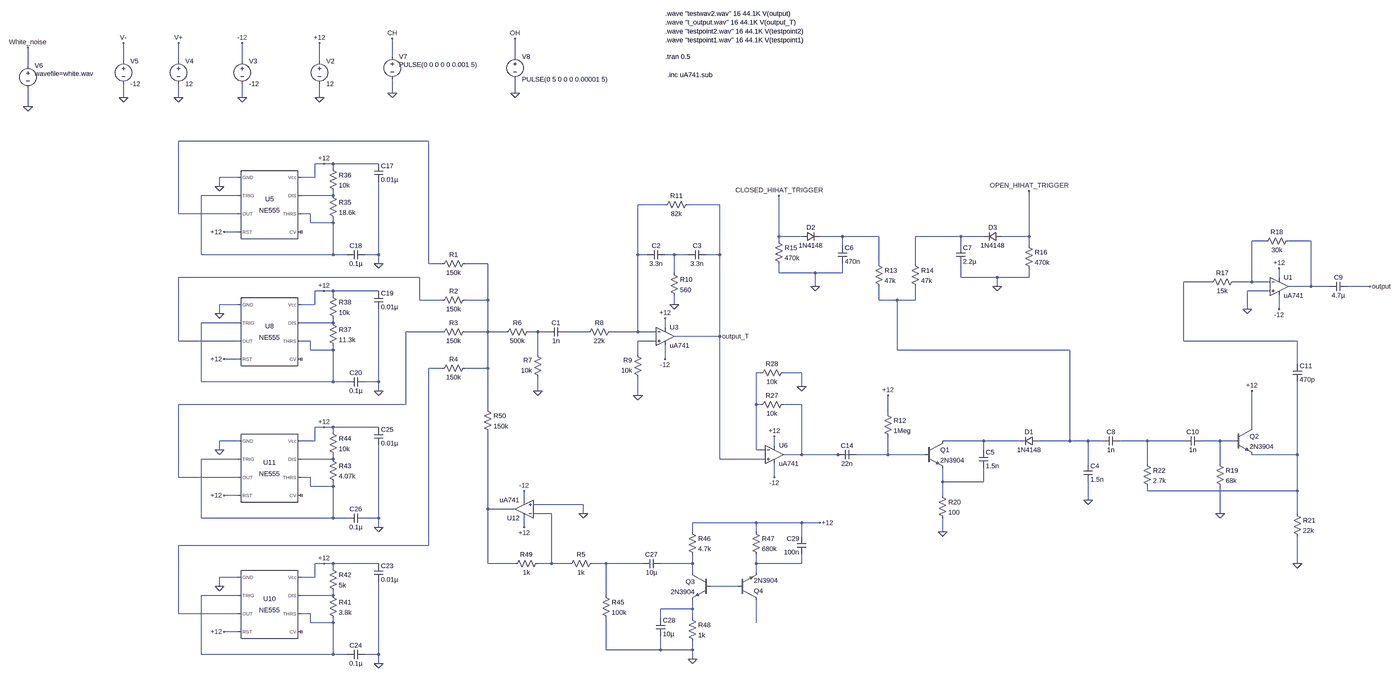
[diagram p0: schematic Hi Hat Cymbal (With analog white noise generator).asc, whole sheet]
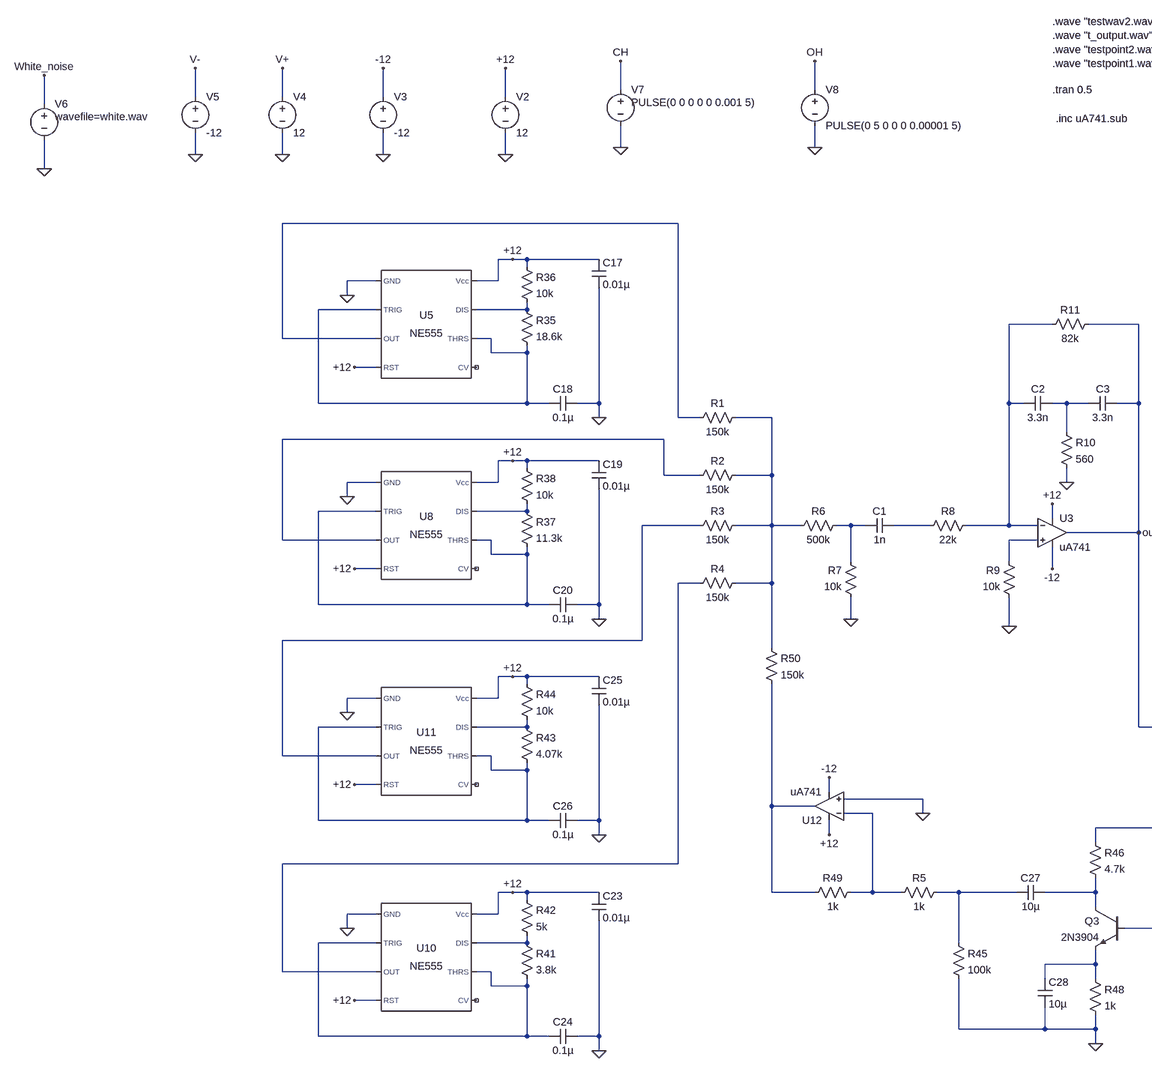
[diagram p1: schematic Hi Hat Cymbal (With analog white noise generator).asc, part, row 1 of 1, column 1 of 2]
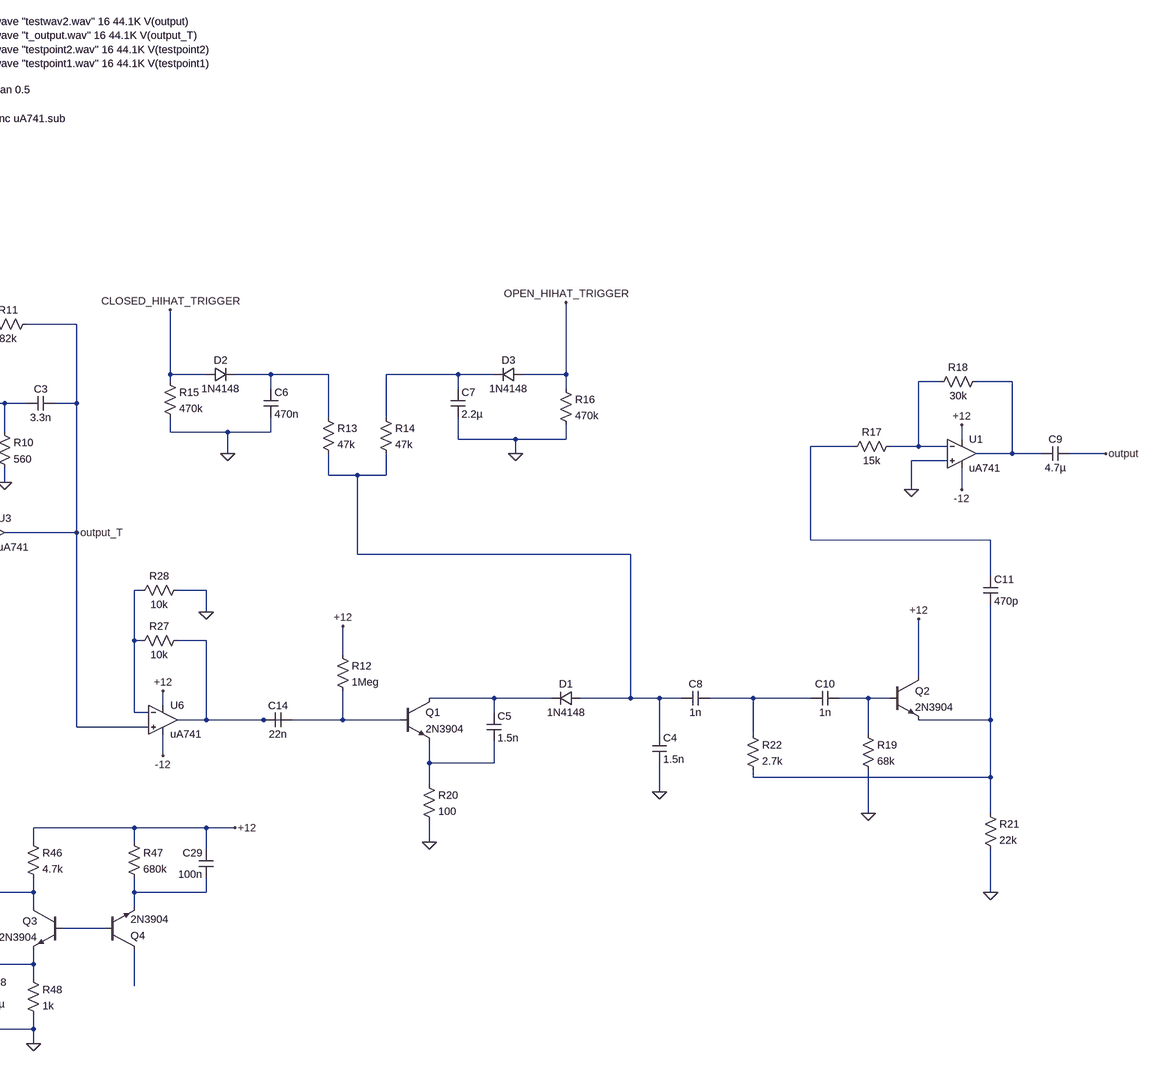
[diagram p2: schematic Hi Hat Cymbal (With analog white noise generator).asc, part, row 1 of 1, column 2 of 2]
Hi Hat Cymbal (With analog white noise generator).asc, the LTspice schematic file:
Version 4
SHEET 1 5820 2708
WIRE -128 -1024 -128 -1088
WIRE 304 -1024 304 -1088
WIRE -1152 -1008 -1152 -1072
WIRE -880 -1008 -880 -1072
WIRE -656 -1008 -656 -1072
WIRE -384 -1008 -384 -1072
WIRE -1488 -992 -1488 -1056
WIRE -128 -896 -128 -944
WIRE 304 -896 304 -944
WIRE -1152 -880 -1152 -928
WIRE -880 -880 -880 -928
WIRE -656 -880 -656 -928
WIRE -384 -880 -384 -928
WIRE -1488 -848 -1488 -912
WIRE 0 -320 -880 -320
WIRE -368 -240 -400 -240
WIRE -336 -240 -368 -240
WIRE -176 -240 -336 -240
WIRE -336 -224 -336 -240
WIRE -672 -192 -736 -192
WIRE -400 -192 -400 -240
WIRE -400 -192 -448 -192
WIRE -736 -160 -736 -192
WIRE -672 -128 -800 -128
WIRE -336 -128 -336 -144
WIRE -336 -128 -448 -128
WIRE 832 -96 736 -96
WIRE 1024 -96 912 -96
WIRE -880 -64 -880 -320
WIRE -672 -64 -880 -64
WIRE -416 -64 -448 -64
WIRE -416 -32 -416 -64
WIRE -336 -32 -336 -48
WIRE -336 -32 -416 -32
WIRE -672 0 -720 0
WIRE 1232 16 1232 -128
WIRE 1312 16 1232 16
WIRE 1456 16 1376 16
WIRE 1584 16 1456 16
WIRE 1872 16 1712 16
WIRE 1952 16 1872 16
WIRE 2112 16 2112 -144
WIRE 2112 16 2016 16
WIRE 1232 32 1232 16
WIRE 2944 32 2896 32
WIRE 3104 32 3024 32
WIRE 1456 48 1456 16
WIRE 1872 48 1872 16
WIRE 2112 48 2112 16
WIRE -800 80 -800 -128
WIRE -336 80 -336 -32
WIRE -336 80 -800 80
WIRE -288 80 -336 80
WIRE -176 80 -176 -176
WIRE -176 80 -224 80
WIRE 736 80 736 -96
WIRE 768 80 736 80
WIRE 864 80 832 80
WIRE 912 80 864 80
WIRE 1024 80 1024 -96
WIRE 1024 80 976 80
WIRE -176 112 -176 80
WIRE 0 112 0 -320
WIRE 48 112 0 112
WIRE 208 112 128 112
WIRE 1584 112 1584 16
WIRE 1712 112 1712 16
WIRE 864 144 864 80
WIRE 1232 144 1232 112
WIRE 1360 144 1232 144
WIRE 1456 144 1456 112
WIRE 1456 144 1360 144
WIRE -32 160 -880 160
WIRE 1872 160 1872 112
WIRE 2000 160 1872 160
WIRE 2112 160 2112 128
WIRE 2112 160 2000 160
WIRE 2992 160 2992 128
WIRE 2752 176 2656 176
WIRE 2896 176 2896 32
WIRE 2896 176 2832 176
WIRE 2960 176 2896 176
WIRE 1360 192 1360 144
WIRE 2000 192 2000 160
WIRE 3104 192 3104 32
WIRE 3104 192 3024 192
WIRE 3168 192 3104 192
WIRE 3312 192 3232 192
WIRE -368 208 -400 208
WIRE -336 208 -368 208
WIRE -176 208 -336 208
WIRE 2960 208 2880 208
WIRE -336 224 -336 208
WIRE -32 240 -32 160
WIRE 48 240 -32 240
WIRE 208 240 208 112
WIRE 208 240 128 240
WIRE 1584 240 1584 192
WIRE 1648 240 1584 240
WIRE 1712 240 1712 192
WIRE 1712 240 1648 240
WIRE -672 256 -736 256
WIRE -400 256 -400 208
WIRE -400 256 -448 256
WIRE 864 256 864 224
WIRE 2880 272 2880 208
WIRE 2992 272 2992 224
WIRE -736 288 -736 256
WIRE -672 320 -800 320
WIRE -336 320 -336 304
WIRE -336 320 -448 320
WIRE 832 336 832 304
WIRE 48 352 -80 352
WIRE 208 352 208 240
WIRE 208 352 128 352
WIRE 272 352 208 352
WIRE 384 352 352 352
WIRE 416 352 384 352
WIRE 560 352 480 352
WIRE 736 352 736 80
WIRE 736 352 640 352
WIRE 800 352 736 352
WIRE 1024 368 1024 80
WIRE 1024 368 864 368
WIRE -880 384 -880 160
WIRE -672 384 -880 384
WIRE -416 384 -448 384
WIRE 800 384 736 384
WIRE 2656 384 2656 176
WIRE 3056 384 2656 384
WIRE -416 416 -416 384
WIRE -336 416 -336 400
WIRE -336 416 -416 416
WIRE 1648 416 1648 240
WIRE 2256 416 1648 416
WIRE 384 432 384 352
WIRE 736 432 736 384
WIRE -672 448 -720 448
WIRE 832 448 832 400
WIRE 3056 464 3056 384
WIRE 48 480 0 480
WIRE 208 480 208 352
WIRE 208 480 128 480
WIRE 1168 496 1152 496
WIRE 1312 496 1248 496
WIRE -800 528 -800 320
WIRE -336 528 -336 416
WIRE -336 528 -800 528
WIRE -288 528 -336 528
WIRE -176 528 -176 272
WIRE -176 528 -224 528
WIRE 1312 544 1312 496
WIRE -176 560 -176 528
WIRE 384 560 384 512
WIRE 736 576 736 512
WIRE -80 608 -80 352
WIRE -80 608 -880 608
WIRE 1152 608 1152 496
WIRE 1168 608 1152 608
WIRE 1312 608 1248 608
WIRE 208 624 208 480
WIRE 1616 640 1616 576
WIRE -368 688 -400 688
WIRE -336 688 -368 688
WIRE -176 688 -336 688
WIRE 2896 688 2896 560
WIRE -336 704 -336 688
WIRE -672 736 -736 736
WIRE -400 736 -400 688
WIRE -400 736 -448 736
WIRE 1952 736 1808 736
WIRE 2080 736 1952 736
WIRE 2256 736 2256 416
WIRE 2256 736 2144 736
WIRE 2320 736 2256 736
WIRE 2368 736 2320 736
WIRE 2528 736 2432 736
WIRE 2656 736 2528 736
WIRE 2784 736 2720 736
WIRE 2832 736 2784 736
WIRE 1216 752 1216 720
WIRE -736 768 -736 736
WIRE 1152 768 1152 608
WIRE 1184 768 1152 768
WIRE 1952 768 1952 736
WIRE 1312 784 1312 608
WIRE 1312 784 1248 784
WIRE 1440 784 1312 784
WIRE 1488 784 1440 784
WIRE 1616 784 1616 720
WIRE 1616 784 1504 784
WIRE 1744 784 1616 784
WIRE 3056 784 3056 528
WIRE 3056 784 2896 784
WIRE -672 800 -800 800
WIRE -336 800 -336 784
WIRE -336 800 -448 800
WIRE 1024 800 1024 368
WIRE 1184 800 1024 800
WIRE 2320 816 2320 736
WIRE 2528 816 2528 736
WIRE 2784 816 2784 736
WIRE -880 864 -880 608
WIRE -672 864 -880 864
WIRE -416 864 -448 864
WIRE 1216 864 1216 816
WIRE 1808 880 1808 832
WIRE 1952 880 1952 832
WIRE 1952 880 1808 880
WIRE -416 896 -416 864
WIRE -336 896 -336 880
WIRE -336 896 -416 896
WIRE 2528 912 2528 896
WIRE 3056 912 3056 784
WIRE 3056 912 2528 912
WIRE -672 928 -720 928
WIRE 1808 928 1808 880
WIRE 336 944 336 912
WIRE 2320 944 2320 880
WIRE 544 960 368 960
WIRE 208 976 208 704
WIRE 304 976 208 976
WIRE 432 992 368 992
WIRE 544 992 544 960
WIRE 2784 992 2784 896
WIRE 3056 992 3056 912
WIRE -800 1008 -800 800
WIRE -336 1008 -336 896
WIRE -336 1008 -800 1008
WIRE -288 1008 -336 1008
WIRE -176 1008 -176 752
WIRE -176 1008 -224 1008
WIRE 1152 1024 928 1024
WIRE 1312 1024 1152 1024
WIRE 1376 1024 1312 1024
WIRE -176 1040 -176 1008
WIRE 336 1040 336 1008
WIRE 928 1056 928 1024
WIRE 1152 1056 1152 1024
WIRE 1808 1056 1808 1008
WIRE 1312 1072 1312 1024
WIRE 0 1104 0 480
WIRE 0 1104 -880 1104
WIRE -368 1168 -400 1168
WIRE -336 1168 -368 1168
WIRE -176 1168 -336 1168
WIRE 208 1168 208 976
WIRE 304 1168 208 1168
WIRE 432 1168 432 992
WIRE 432 1168 384 1168
WIRE 496 1168 432 1168
WIRE 624 1168 576 1168
WIRE 752 1168 624 1168
WIRE 928 1168 928 1136
WIRE 928 1168 816 1168
WIRE 1152 1168 1152 1136
WIRE 1312 1168 1312 1136
WIRE 1312 1168 1152 1168
WIRE 3056 1168 3056 1072
WIRE -336 1184 -336 1168
WIRE 928 1200 928 1168
WIRE 1152 1200 1152 1168
WIRE -672 1216 -736 1216
WIRE -400 1216 -400 1168
WIRE -400 1216 -448 1216
WIRE -736 1248 -736 1216
WIRE 1088 1248 992 1248
WIRE -672 1280 -800 1280
WIRE -336 1280 -336 1264
WIRE -336 1280 -448 1280
WIRE 624 1280 624 1168
WIRE 928 1328 928 1296
WIRE 928 1328 816 1328
WIRE -880 1344 -880 1104
WIRE -672 1344 -880 1344
WIRE -416 1344 -448 1344
WIRE 816 1360 816 1328
WIRE 928 1360 928 1328
WIRE -416 1376 -416 1344
WIRE -336 1376 -336 1360
WIRE -336 1376 -416 1376
WIRE 1152 1376 1152 1296
WIRE -672 1408 -720 1408
WIRE 624 1472 624 1360
WIRE 816 1472 816 1424
WIRE 816 1472 624 1472
WIRE 928 1472 928 1440
WIRE 928 1472 816 1472
WIRE -800 1488 -800 1280
WIRE -336 1488 -336 1376
WIRE -336 1488 -800 1488
WIRE -288 1488 -336 1488
WIRE -176 1488 -176 1232
WIRE -176 1488 -224 1488
WIRE 928 1504 928 1472
WIRE -176 1520 -176 1488
FLAG 384 560 0
FLAG 736 576 0
FLAG 864 256 0
FLAG 1616 576 +12
FLAG -384 -880 0
FLAG -656 -880 0
FLAG -384 -1072 +12
FLAG -656 -1072 -12
FLAG 832 448 -12
FLAG 832 304 +12
FLAG 1360 192 0
FLAG 1232 -128 CLOSED_HIHAT_TRIGGER
FLAG 2112 -144 OPEN_HIHAT_TRIGGER
FLAG 2000 192 0
FLAG -880 -880 0
FLAG -1152 -880 0
FLAG -880 -1072 V+
FLAG -1152 -1072 V-
FLAG -1488 -848 0
FLAG -1488 -1056 White_noise
FLAG 2992 272 -12
FLAG 2992 128 +12
FLAG 2880 272 0
FLAG -128 -896 0
FLAG -128 -1088 CH
FLAG 3312 192 output
FLAG 304 -896 0
FLAG 304 -1088 OH
FLAG 1024 368 output_T
FLAG 1808 1056 0
FLAG 1216 864 -12
FLAG 1216 720 +12
FLAG 2320 944 0
FLAG 2896 560 +12
FLAG 2784 992 0
FLAG 3056 1168 0
FLAG -736 -160 0
FLAG -368 -240 +12
FLAG -720 0 +12
FLAG -176 112 0
FLAG -736 288 0
FLAG -368 208 +12
FLAG -720 448 +12
FLAG -176 560 0
FLAG -736 1248 0
FLAG -368 1168 +12
FLAG -720 1408 +12
FLAG -176 1520 0
FLAG -736 768 0
FLAG -368 688 +12
FLAG -720 928 +12
FLAG -176 1040 0
FLAG 928 1504 0
FLAG 1376 1024 +12
FLAG 336 912 -12
FLAG 336 1040 +12
FLAG 544 992 0
FLAG 1312 544 0
SYMBOL res 144 96 R90
WINDOW 0 0 56 VBottom 2
WINDOW 3 32 56 VTop 2
SYMATTR InstName R1
SYMATTR Value 150k
SYMBOL res 144 224 R90
WINDOW 0 0 56 VBottom 2
WINDOW 3 32 56 VTop 2
SYMATTR InstName R2
SYMATTR Value 150k
SYMBOL res 144 336 R90
WINDOW 0 0 56 VBottom 2
WINDOW 3 32 56 VTop 2
SYMATTR InstName R3
SYMATTR Value 150k
SYMBOL res 144 464 R90
WINDOW 0 0 56 VBottom 2
WINDOW 3 32 56 VTop 2
SYMATTR InstName R4
SYMATTR Value 150k
SYMBOL res 368 336 R90
WINDOW 0 0 56 VBottom 2
WINDOW 3 32 56 VTop 2
SYMATTR InstName R6
SYMATTR Value 500k
SYMBOL res 400 528 R180
WINDOW 0 36 76 Left 2
WINDOW 3 36 40 Left 2
SYMATTR InstName R7
SYMATTR Value 10k
SYMBOL cap 480 336 R90
WINDOW 0 0 32 VBottom 2
WINDOW 3 32 32 VTop 2
SYMATTR InstName C1
SYMATTR Value 1n
SYMBOL res 656 336 R90
WINDOW 0 0 56 VBottom 2
WINDOW 3 32 56 VTop 2
SYMATTR InstName R8
SYMATTR Value 22k
SYMBOL res 752 528 R180
WINDOW 0 36 76 Left 2
WINDOW 3 36 40 Left 2
SYMATTR InstName R9
SYMATTR Value 10k
SYMBOL cap 832 64 R90
WINDOW 0 0 32 VBottom 2
WINDOW 3 32 32 VTop 2
SYMATTR InstName C2
SYMATTR Value 3.3n
SYMBOL cap 976 64 R90
WINDOW 0 0 32 VBottom 2
WINDOW 3 32 32 VTop 2
SYMATTR InstName C3
SYMATTR Value 3.3n
SYMBOL res 848 128 R0
SYMATTR InstName R10
SYMATTR Value 560
SYMBOL res 928 -112 R90
WINDOW 0 0 56 VBottom 2
WINDOW 3 32 56 VTop 2
SYMATTR InstName R11
SYMATTR Value 82k
SYMBOL res 1600 624 R0
SYMATTR InstName R12
SYMATTR Value 1Meg
SYMBOL npn 1744 736 R0
SYMATTR InstName Q1
SYMATTR Value 2N3904
SYMBOL cap 1936 768 R0
SYMATTR InstName C5
SYMATTR Value 1.5n
SYMBOL voltage -384 -1024 R0
WINDOW 123 0 0 Left 2
WINDOW 39 0 0 Left 2
SYMATTR InstName V2
SYMATTR Value 12
SYMBOL voltage -656 -1024 R0
WINDOW 123 0 0 Left 2
WINDOW 39 0 0 Left 2
SYMATTR InstName V3
SYMATTR Value -12
SYMBOL diode 2144 720 R90
WINDOW 0 0 32 VBottom 2
WINDOW 3 32 32 VTop 2
SYMATTR InstName D1
SYMATTR Value 1N4148
SYMBOL res 1568 96 R0
SYMATTR InstName R13
SYMATTR Value 47k
SYMBOL res 1696 96 R0
SYMATTR InstName R14
SYMATTR Value 47k
SYMBOL cap 1440 48 R0
SYMATTR InstName C6
SYMATTR Value 470n
SYMBOL diode 1312 32 R270
WINDOW 0 32 32 VTop 2
WINDOW 3 0 32 VBottom 2
SYMATTR InstName D2
SYMATTR Value 1N4148
SYMBOL res 1216 16 R0
SYMATTR InstName R15
SYMATTR Value 470k
SYMBOL cap 1856 48 R0
SYMATTR InstName C7
SYMATTR Value 2.2µ
SYMBOL diode 2016 0 R90
WINDOW 0 0 32 VBottom 2
WINDOW 3 32 32 VTop 2
SYMATTR InstName D3
SYMATTR Value 1N4148
SYMBOL res 2096 32 R0
SYMATTR InstName R16
SYMATTR Value 470k
SYMBOL cap 2432 720 R90
WINDOW 0 0 32 VBottom 2
WINDOW 3 32 32 VTop 2
SYMATTR InstName C8
SYMATTR Value 1n
SYMBOL voltage -880 -1024 R0
WINDOW 123 0 0 Left 2
WINDOW 39 0 0 Left 2
SYMATTR InstName V4
SYMATTR Value 12
SYMBOL voltage -1152 -1024 R0
WINDOW 123 0 0 Left 2
WINDOW 39 0 0 Left 2
SYMATTR InstName V5
SYMATTR Value -12
SYMBOL voltage -1488 -1008 R0
WINDOW 3 24 44 Left 2
SYMATTR Value wavefile=white.wav
SYMATTR InstName V6
SYMBOL res 2848 160 R90
WINDOW 0 0 56 VBottom 2
WINDOW 3 32 56 VTop 2
SYMATTR InstName R17
SYMATTR Value 15k
SYMBOL res 3040 16 R90
WINDOW 0 0 56 VBottom 2
WINDOW 3 32 56 VTop 2
SYMATTR InstName R18
SYMATTR Value 30k
SYMBOL cap 3232 176 R90
WINDOW 0 0 32 VBottom 2
WINDOW 3 32 32 VTop 2
SYMATTR InstName C9
SYMATTR Value 4.7µ
SYMBOL voltage -128 -1040 R0
WINDOW 123 0 0 Left 2
WINDOW 39 0 0 Left 2
WINDOW 3 24 44 Left 2
SYMATTR Value PULSE(0 0 0 0 0 0.001 5)
SYMATTR InstName V7
SYMBOL voltage 304 -1040 R0
WINDOW 123 0 0 Left 2
WINDOW 39 0 0 Left 2
SYMATTR InstName V8
SYMATTR Value PULSE(0 5 0 0 0 0.00001 5)
SYMBOL Opamps\\opamp2 832 304 R0
SYMATTR InstName U3
SYMATTR Value uA741
SYMBOL Opamps\\opamp2 2992 128 R0
SYMATTR InstName U1
SYMATTR Value uA741
SYMBOL res 1792 912 R0
SYMATTR InstName R20
SYMATTR Value 100
SYMBOL Opamps\\opamp2 1216 720 R0
SYMATTR InstName U6
SYMATTR Value uA741
SYMBOL res 1264 592 R90
WINDOW 0 0 56 VBottom 2
WINDOW 3 32 56 VTop 2
SYMATTR InstName R27
SYMATTR Value 10k
SYMBOL res 1152 512 R270
WINDOW 0 32 56 VTop 2
WINDOW 3 0 56 VBottom 2
SYMATTR InstName R28
SYMATTR Value 10k
SYMBOL cap 1504 768 R90
WINDOW 0 0 32 VBottom 2
WINDOW 3 32 32 VTop 2
SYMATTR InstName C14
SYMATTR Value 22n
SYMBOL cap 2304 816 R0
SYMATTR InstName C4
SYMATTR Value 1.5n
SYMBOL cap 2720 720 R90
WINDOW 0 0 32 VBottom 2
WINDOW 3 32 32 VTop 2
SYMATTR InstName C10
SYMATTR Value 1n
SYMBOL npn 2832 688 R0
SYMATTR InstName Q2
SYMATTR Value 2N3904
SYMBOL res 2768 800 R0
SYMATTR InstName R19
SYMATTR Value 68k
SYMBOL res 3040 976 R0
SYMATTR InstName R21
SYMATTR Value 22k
SYMBOL res 2512 800 R0
SYMATTR InstName R22
SYMATTR Value 2.7k
SYMBOL cap 3040 464 R0
SYMATTR InstName C11
SYMATTR Value 470p
SYMBOL Misc\\NE555 -560 -96 R0
SYMATTR InstName U5
SYMBOL res -352 -144 R0
SYMATTR InstName R35
SYMATTR Value 18.6k
SYMBOL res -352 -240 R0
SYMATTR InstName R36
SYMATTR Value 10k
SYMBOL cap -192 -240 R0
SYMATTR InstName C17
SYMATTR Value 0.01µ
SYMBOL cap -224 64 R90
WINDOW 0 0 32 VBottom 2
WINDOW 3 32 32 VTop 2
SYMATTR InstName C18
SYMATTR Value 0.1µ
SYMBOL Misc\\NE555 -560 352 R0
SYMATTR InstName U8
SYMBOL res -352 304 R0
SYMATTR InstName R37
SYMATTR Value 11.3k
SYMBOL res -352 208 R0
SYMATTR InstName R38
SYMATTR Value 10k
SYMBOL cap -192 208 R0
SYMATTR InstName C19
SYMATTR Value 0.01µ
SYMBOL cap -224 512 R90
WINDOW 0 0 32 VBottom 2
WINDOW 3 32 32 VTop 2
SYMATTR InstName C20
SYMATTR Value 0.1µ
SYMBOL Misc\\NE555 -560 1312 R0
SYMATTR InstName U10
SYMBOL res -352 1264 R0
SYMATTR InstName R41
SYMATTR Value 3.8k
SYMBOL res -352 1168 R0
SYMATTR InstName R42
SYMATTR Value 5k
SYMBOL cap -192 1168 R0
SYMATTR InstName C23
SYMATTR Value 0.01µ
SYMBOL cap -224 1472 R90
WINDOW 0 0 32 VBottom 2
WINDOW 3 32 32 VTop 2
SYMATTR InstName C24
SYMATTR Value 0.1µ
SYMBOL Misc\\NE555 -560 832 R0
SYMATTR InstName U11
SYMBOL res -352 784 R0
SYMATTR InstName R43
SYMATTR Value 4.07k
SYMBOL res -352 688 R0
SYMATTR InstName R44
SYMATTR Value 10k
SYMBOL cap -192 688 R0
SYMATTR InstName C25
SYMATTR Value 0.01µ
SYMBOL cap -224 992 R90
WINDOW 0 0 32 VBottom 2
WINDOW 3 32 32 VTop 2
SYMATTR InstName C26
SYMATTR Value 0.1µ
SYMBOL npn 992 1200 M0
SYMATTR InstName Q3
SYMATTR Value 2N3904
SYMBOL res 608 1264 R0
SYMATTR InstName R45
SYMATTR Value 100k
SYMBOL cap 816 1152 R90
WINDOW 0 0 32 VBottom 2
WINDOW 3 32 32 VTop 2
SYMATTR InstName C27
SYMATTR Value 10µ
SYMBOL npn 1088 1296 M180
SYMATTR InstName Q4
SYMATTR Value 2N3904
SYMBOL res 912 1040 R0
SYMATTR InstName R46
SYMATTR Value 4.7k
SYMBOL res 1136 1040 R0
SYMATTR InstName R47
SYMATTR Value 680k
SYMBOL res 912 1344 R0
SYMATTR InstName R48
SYMATTR Value 1k
SYMBOL cap 800 1360 R0
SYMATTR InstName C28
SYMATTR Value 10µ
SYMBOL cap 1328 1136 R180
WINDOW 0 24 56 Left 2
WINDOW 3 24 8 Left 2
SYMATTR InstName C29
SYMATTR Value 100n
SYMBOL Opamps\\opamp2 336 1040 R180
SYMATTR InstName U12
SYMATTR Value uA741
SYMBOL res 480 1184 R270
WINDOW 0 32 56 VTop 2
WINDOW 3 0 56 VBottom 2
SYMATTR InstName R5
SYMATTR Value 1k
SYMBOL res 400 1152 R90
WINDOW 0 0 56 VBottom 2
WINDOW 3 32 56 VTop 2
SYMATTR InstName R49
SYMATTR Value 1k
SYMBOL res 192 608 R0
SYMATTR InstName R50
SYMATTR Value 150k
TEXT 832 -1024 Left 2 !.tran 0.5
TEXT 832 -1176 Left 2 !.wave "testwav2.wav" 16 44.1K V(output)\n.wave "t_output.wav" 16 44.1K V(output_T)\n.wave "testpoint2.wav" 16 44.1K V(testpoint2)\n.wave "testpoint1.wav" 16 44.1K V(testpoint1)
TEXT 840 -960 Left 2 !.inc uA741.sub

The netlist it stands for:
* Hi Hat Cymbal (With analog white noise generator).asc
R1 N010 N001 150k
R2 N010 N011 150k
R3 N010 N016 150k
R4 N010 N020 150k
R6 N017 N010 500k
R7 0 N017 10k
C1 N018 N017 1n
R8 N004 N018 22k
R9 0 N019 10k
C2 N009 N004 3.3n
C3 output_T N009 3.3n
R10 N009 0 560
R11 output_T N004 82k
R12 +12 N026 1Meg
Q1 N023 N026 N030 0 2N3904
C5 N023 N030 1.5n
V2 +12 0 12
V3 -12 0 -12
D1 N013 N023 1N4148
R13 N005 N013 47k
R14 N006 N013 47k
C6 N005 0 470n
D2 CLOSED_HIHAT_TRIGGER N005 1N4148
R15 CLOSED_HIHAT_TRIGGER 0 470k
C7 N006 0 2.2µ
D3 OPEN_HIHAT_TRIGGER N006 1N4148
R16 OPEN_HIHAT_TRIGGER 0 470k
C8 N024 N013 1n
V4 V+ 0 12
V5 V- 0 -12
V6 White_noise 0 wavefile=white.wav
R17 N007 N012 15k
R18 N008 N007 30k
C9 output N008 4.7µ
V7 CH 0 PULSE(0 0 0 0 0 0.001 5)
V8 OH 0 PULSE(0 5 0 0 0 0.00001 5)
XU3 N019 N004 +12 -12 output_T uA741  ; pins In+ In- V+ V- OUT
XU1 0 N007 +12 -12 N008 uA741  ; pins In+ In- V+ V- OUT
R20 N030 0 100
XU6 output_T N021 +12 -12 N022 uA741  ; pins In+ In- V+ V- OUT
R27 N022 N021 10k
R28 N021 0 10k
C14 N026 N022 22n
C4 N013 0 1.5n
C10 N025 N024 1n
Q2 +12 N025 N027 0 2N3904
R19 N025 0 68k
R21 N027 0 22k
R22 N024 N027 2.7k
C11 N012 N027 470p
XU5 0 N002 N001 +12 NC_01 N002 N003 +12 NE555  ; pins GND TRIG OUT RST CV THRS DIS Vcc
R35 N003 N002 18.6k
R36 +12 N003 10k
C17 +12 0 0.01µ
C18 0 N002 0.1µ
XU8 0 N014 N011 +12 NC_02 N014 N015 +12 NE555  ; pins GND TRIG OUT RST CV THRS DIS Vcc
R37 N015 N014 11.3k
R38 +12 N015 10k
C19 +12 0 0.01µ
C20 0 N014 0.1µ
XU10 0 N037 N020 +12 NC_03 N037 N038 +12 NE555  ; pins GND TRIG OUT RST CV THRS DIS Vcc
R41 N038 N037 3.8k
R42 +12 N038 5k
C23 +12 0 0.01µ
C24 0 N037 0.1µ
XU11 0 N028 N016 +12 NC_04 N028 N029 +12 NE555  ; pins GND TRIG OUT RST CV THRS DIS Vcc
R43 N029 N028 4.07k
R44 +12 N029 10k
C25 +12 0 0.01µ
C26 0 N028 0.1µ
Q3 N034 N036 N039 0 2N3904
R45 N033 0 100k
C27 N034 N033 10µ
Q4 N040 N036 N035 0 2N3904
R46 +12 N034 4.7k
R47 +12 N035 680k
R48 N039 0 1k
C28 N039 0 10µ
C29 N035 +12 100n
XU12 0 N032 +12 -12 N031 uA741  ; pins In+ In- V+ V- OUT
R5 N032 N033 1k
R49 N032 N031 1k
R50 N010 N031 150k
.model D D
.lib standard.dio
.model NPN NPN
.model PNP PNP
.lib standard.bjt
.tran 0.5
.wave "testwav2.wav" 16 44.1K V(output)
.wave "t_output.wav" 16 44.1K V(output_T)
.wave "testpoint2.wav" 16 44.1K V(testpoint2)
.wave "testpoint1.wav" 16 44.1K V(testpoint1)
.inc uA741.sub
.lib NE555.sub
.backanno
.end